# Altium project STM32 with one sensor.PrjPcb
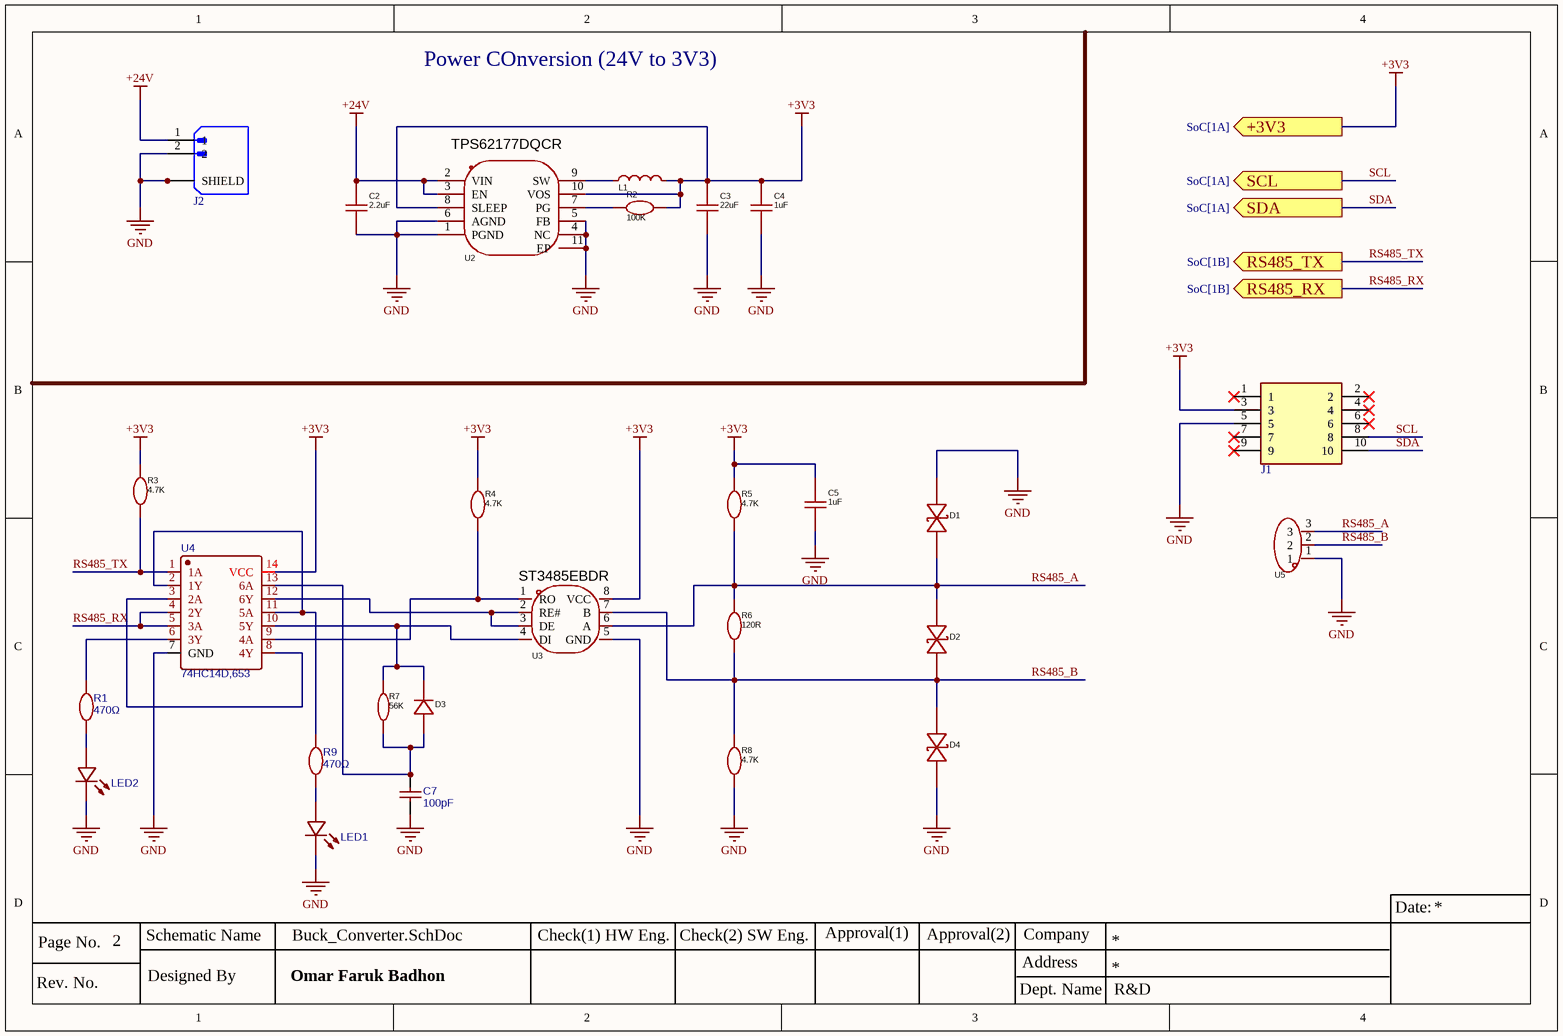
[diagram p0: Buck_Converter.SchDoc]
3 sheets, 38 parts. Net scope: flat (ports and power ports of the same name join across sheets).
Board file: PCB of SMT32.PcbDoc
Sheets:
  Project Overview.SchDoc
  Buck_Converter.SchDoc
  SoC.SchDoc

## Sheet Project Overview.SchDoc
size A4; SheetNumber: 1; SheetTotal: 3

### Notes on the sheet
- Date:
- Rev. No.
- Page No.
- Schematic Name
- Designed By
- Omar Faruk Badhon
- Check(1) HW Eng.
- Check(2) SW Eng.
- Approval(1)
- Approval(2)
- Address
- Company
- Dept. Name
- R&D

## Sheet Buck_Converter.SchDoc
size A4; SheetNumber: 2; SheetTotal: 3

### Parts
C2  2.2uF  [Cap 2.2uF]
C3  22uF  [Cap 22uF]
C4  1uF  [Cap 1uF]
C5  1uF  [Cap 1uF]
C7  100pF  [Cap 100pF]
D1  SMAJ58CA  [TVS diode]  (value not drawn)
D2  SMAJ58CA  [TVS diode]  (value not drawn)
D3  1N4148W  [1N4148W]  (value not drawn)
D4  SMAJ58CA  [TVS diode]  (value not drawn)
J1  CLP-105-02-L-D  [Sesnor Connector]  (value not drawn)
J2  Power Connector  [Power Connector]  (value not drawn)
L1  LPS4018-103MRC  [Inductor]  (value not drawn)
LED1  VLMS1300-GS08  [LED]  (value not drawn)
LED2  VLMS1300-GS08  [LED]  (value not drawn)
R1  470Ω  [Res 470R]
R2  100K  [Res 100K]
R3  4.7K  [Res 4.7K]
R4  4.7K  [Res 4.7K]
R5  4.7K  [Res 4.7K]
R6  120R  [Res 120R]
R7  56K  [Rs 56K]
R8  4.7K  [Res 4.7K]
R9  470Ω  [Res 470R]
U2  TPS62177DQCR  [TPS62177DQCR]
U3  ST3485EBDR  [ST3485EBDR]
U4  74HC14D,653  [74HC14D]
U5  733-363  [RS485 connector]  (value not drawn)

### Ports
+3V3 (out, see SoC[1A]), RS485_RX (out, see SoC[1B]), RS485_TX (out, see SoC[1B]), SCL (out, see SoC[1A]), SDA (out, see SoC[1A])

### Nets
+3V3: C3.2 C4.2 C5.2 J1.3 L1.2 R2.2 R3.2 R4.2 R5.2 U2.8(SLEEP) U2.10(VOS) U3.8(VCC) U4.14(VCC) ; port +3V3
+24V: C2.2 J2.1 U2.2(VIN) U2.3(EN)
GND: C2.1 C3.1 C4.1 C5.1 C7.1 D1.2 D4.1 J1.5 J2.2 J2.S1(SHIELD) J2.S2(SHIELD) LED1.2(C) LED2.2(C) R8.1 U2.1(PGND) U2.4(NC) U2.5(FB) U2.6(AGND) U2.11(EP) U3.5(GND) U4.7(GND) U5.1
RS485_A: D1.1 D2.2 R5.1 R6.2 U3.6(A) U5.3
RS485_B: D2.1 D4.2 R6.1 R8.2 U3.7(B) U5.2
RS485_RX: U4.4(2Y) U4.5(3A) ; port RS485_RX
RS485_TX: R3.1 U4.1(1A) ; port RS485_TX
SCL: J1.8 ; port SCL
SDA: J1.10 ; port SDA
NetC7_2: C7.2 D3.2(A) R7.1 U4.13(6A)
NetD3_1: D3.1(K) R7.2 U3.4(DI) U4.10(5Y)
NetL1_1: L1.1 U2.9(SW)
NetLED1_1: LED1.1(A) R9.1
NetLED2_1: LED2.1(A) R1.1
NetR1_2: R1.2 U4.6(3Y)
NetR2_1: R2.1 U2.7(PG)
NetR4_1: R4.1 U3.1(RO) U4.9(4A)
NetR9_2: R9.2 U4.2(1Y) U4.11(5A)
NetU3_2: U3.2(RE#) U3.3(DE) U4.12(6Y)
NetU4_3: U4.3(2A) U4.8(4Y)

Not connected (* = marked no-connect by the designer): J1 1* 2* 4* 6* 7* 9*

### Notes on the sheet
- Power COnversion (24V to 3V3)
- Date:
- Rev. No.
- Page No.
- Schematic Name
- Designed By
- Omar Faruk Badhon
- Check(1) HW Eng.
- Check(2) SW Eng.
- Approval(1)
- Approval(2)
- Address
- Company
- Dept. Name
- R&D

### Library data of the parts
C2 = GRM155R6YA225KE11D: Cap 2.2uF 35V; Manufacturer: muRata(村田); Add into BOM: yes; Tolerance: ±10%; Symbol: GRM155R6YA225KE11D; Device: GRM155R6YA225KE11D; LCSC Part Name: 2.2uF ±10% 35V; Supplier Part: C237392; Manufacturer Part: GRM155R6YA225KE11D; Supplier Footprint: 0402; JLCPCB Part Class: Extended Part; Datasheet: https://atta.szlcsc.com/upload/public/pdf/source/20200305/C490387_23319AE8C154DEB24C505E6C82A8106A.pdf; Supplier: LCSC; Convert to PCB: yes; Value: 2.2uF
C3 = GRM21BC81C226ME44L: Cap 22uF 16V; Manufacturer: muRata(村田); Add into BOM: yes; Tolerance: ±20%; Symbol: GRM21BC81C226ME44L; Device: GRM21BC81C226ME44L; LCSC Part Name: 22uF ±20% 16V; Supplier Part: C258782; Manufacturer Part: GRM21BC81C226ME44L; Supplier Footprint: 0805; JLCPCB Part Class: Extended Part; Datasheet: https://atta.szlcsc.com/upload/public/pdf/source/20200117/C258782_354729B55DBAD136BAA783E298FE5367.pdf; Supplier: LCSC; Convert to PCB: yes; Value: 22uF
C4 C5 = GCM188R71C105KA64D: Cap 1uF 16V; Manufacturer: muRata(村田); Add into BOM: yes; Tolerance: ±10%; Symbol: GCM188R71C105KA64D; Device: GCM188R71C105KA64D; LCSC Part Name: 1uF ±10% 16V; Supplier Part: C161212; Manufacturer Part: GCM188R71C105KA64D; Supplier Footprint: 0603; JLCPCB Part Class: Extended Part; Datasheet: https://atta.szlcsc.com/upload/public/pdf/source/20181221/C161212_C96DD77354D5551432B3B7779E4D1948.pdf; Supplier: LCSC; Convert to PCB: yes; Value: 1uF
C7 = 100pF: Cap 100pF 50V; Manufacturer: muRata(村田); Manufacturer Part: GCM1885C1H101JA16D; nameAlias: Value; Supplier: LCSC; Supplier Part: C126543; JLCPCB Part Class: Extended Part; spicePre: C; spiceSymbolName: GCM1885C1H101JA16D
D1 D2 D4 = SMAJ58CA_C148235: Manufacturer: Littelfuse(美国力特); Add into BOM: yes; Reverse Stand-Off Voltage (Vrwm): 58V; Maximum Clamping Voltage: 93.6V; Peak Pulse Current (Ipp): 4.3A; Peak Pulse Power Dissipation (Ppp): 400W; Breakdown Voltage: 64.4V; Type: TVS; Symbol: SMAJ58CA_C148235; Device: SMAJ58CA_C148235; LCSC Part Name: SMAJ58CA; Supplier Part: C148235; Manufacturer Part: SMAJ58CA; Supplier Footprint: SMA(DO-214AC); JLCPCB Part Class: Extended Part; Datasheet: https://atta.szlcsc.com/upload/public/pdf/source/20190402/C374025_5ACE77BC72947DF13CF0CBC7F8B57228.pdf; Supplier: LCSC; Convert to PCB: yes
D3 = 1N4148W: Manufacturer: Agertech(艾吉芯); Symbol: 1N4148W_C2840961; Add into BOM: yes; Forward Voltage (Vf@If): 1.25V@150mA; Reverse Leakage Current: 1uA@75V; Device: 1N4148W_C2840961; LCSC Part Name: 电压:100V 电流:150mA; Supplier Part: C2840961; Manufacturer Part: 1N4148W; Supplier Footprint: SOD-123W; JLCPCB Part Class: Extended Part; Datasheet: https://atta.szlcsc.com/upload/public/pdf/source/20210624/C2840961_71DFB6950E76A457E5EE196072A9BD23.pdf; Supplier: LCSC; Convert to PCB: yes; Operating Temperature: -55℃~+150℃@(Tj)
J1 = CLP-105-02-L-D: 1.27mm 1.27mm Double Row Tin 3.3A -55℃~+125℃ 10P Standing paste 2.29mm SMD,P=1.27mm Female Headers ROHS; Package: None; Price: None; Value: *; MP: CLP-105-02-L-D; Availability: Unavailable
J2 = Power Connector: Picoblade Connector, 2 Circuit Single Row, Right Angle Surface Mount SMT PCB; MF: {'manufacturer': u'Molex'}; MP: 0532610271; Availability: Unavailable; Package: None; Value: *; Price: None
L1 = LPS4018-103MRC: Inductor 10uH; Manufacturer: Coilcraft(线艺); Add into BOM: yes; Symbol: LPS4018-103MRC; Device: LPS4018-103MRC; LCSC Part Name: LPS4018-103MRC; Supplier Part: C6127589; Manufacturer Part: LPS4018-103MRC; Supplier Footprint: SMD,3.9x3.9mm; JLCPCB Part Class: Extended Part; Datasheet: https://atta.szlcsc.com/upload/public/pdf/source/20220705/4A26DAB81CB6B332CC15AA1D7F647266.pdf; Supplier: LCSC; Convert to PCB: yes
LED1 LED2 = VLMS1300-GS08: Led; Manufacturer: VISHAY(威世); Contributor: LCSC; Supplier: LCSC; Supplier Part: C83242; Manufacturer Part: VLMS1300-GS08; JLCPCB Part Class: Extended Part; spicePre: L; spiceSymbolName: VLMS1300-GS08
R1 R9 = 470Ω: Res 470R; Manufacturer: PANASONIC(松下); Manufacturer Part: ERJPA3F4700V; nameAlias: Value; Contributor: lcsc; Supplier: LCSC; Supplier Part: C441919; JLCPCB Part Class: Extended Part; spicePre: R; spiceSymbolName: ERJPA3F4700V
R2 = ERA2AEB104X: Res 100K 50V; Manufacturer: PANASONIC(松下); Add into BOM: yes; Value: 100kΩ; Tolerance: ±0.1%; Temperature Coefficient: ±25ppm/℃; Symbol: ERA2AEB104X; Device: ERA2AEB104X; LCSC Part Name: 100kΩ ±0.1% 63mW 薄膜电阻; Supplier Part: C445619; Manufacturer Part: ERA2AEB104X; Supplier Footprint: 0402; JLCPCB Part Class: Extended Part; Supplier: LCSC; Convert to PCB: yes; Type: Thin Film Resistor; Operating Temperature Range: -55℃~+155℃
R3-R5 R8 = ERJPA3F4701V: Res 4.7K; Manufacturer: PANASONIC(松下); Add into BOM: yes; Value: 4.7kΩ; Tolerance: ±1%; Power(Watts): 333mW; Temperature Coefficient: ±100ppm/℃; Symbol: ERJPA3F4701V; Device: ERJPA3F4701V; LCSC Part Name: 4.7kΩ ±1% 333mW 厚膜电阻; Supplier Part: C441924; Manufacturer Part: ERJPA3F4701V; Supplier Footprint: 0603; JLCPCB Part Class: Extended Part; Supplier: LCSC; Convert to PCB: yes; Type: Thick Film Resistors; Overload Voltage (Max): -; Operating Temperature Range: -55℃~+155℃
R6 = ERJPA3F1200V: Res 120R; Manufacturer: PANASONIC(松下); Add into BOM: yes; Value: 120Ω; Tolerance: ±1%; Power(Watts): 250mW; Temperature Coefficient: ±100ppm/℃; Symbol: ERJPA3F1200V; Device: ERJPA3F1200V; LCSC Part Name: 120Ω ±1% 250mW 厚膜电阻; Supplier Part: C543338; Manufacturer Part: ERJPA3F1200V; Supplier Footprint: 0603; JLCPCB Part Class: Extended Part; Datasheet: https://atta.szlcsc.com/upload/public/pdf/source/20200515/C543414_D3FB4A44C151AC19BA141503575FC797.pdf; Supplier: LCSC; Convert to PCB: yes; Type: Thick Film Resistors; Overload Voltage (Max): -; Operating Temperature Range: -55℃~+155℃
R7 = ERJ3EKF5602V: Res 56K; Manufacturer: PANASONIC(松下); Add into BOM: yes; Value: 56kΩ; Tolerance: ±1%; Temperature Coefficient: ±100ppm/℃; Symbol: ERJ3EKF5602V; Device: ERJ3EKF5602V; LCSC Part Name: 56kΩ ±1% 100mW 厚膜电阻; Supplier Part: C278629; Manufacturer Part: ERJ3EKF5602V; Supplier Footprint: 0603; JLCPCB Part Class: Extended Part; Datasheet: https://atta.szlcsc.com/upload/public/pdf/source/20181114/C278629_181D62B106189050D6A2EF7256E211B4.pdf; Supplier: LCSC; Convert to PCB: yes; Type: Thick Film Resistors; Overload Voltage (Max): -; Operating Temperature Range: -55℃~+155℃
U2 = TPS62177DQCR: Manufacturer: TI(德州仪器); Add into BOM: yes; Function: Step-down type; Switch tube (built-in/external): 内置; Symbol: TPS62177DQCR; Device: TPS62177DQCR; LCSC Part Name: TPS62177DQCR; Supplier Part: C91241; Manufacturer Part: TPS62177DQCR; Supplier Footprint: WSON-10-EP(2x3); JLCPCB Part Class: Extended Part; Datasheet: https://www.ti.com/cn/lit/gpn/tps62177; Supplier: LCSC; Convert to PCB: yes; Input Voltage: -; Output Current (Max): -; Switching Frequency: -; Synchronous Rectification: -; Number of Outputs: -; Topology: -
U3 = ST3485EBDR: Manufacturer: ST(意法半导体); Add into BOM: yes; Types: transceiver; Supply Voltage: 3V~3.6V; Data Rate: 15Mbps; Driver/receiver: 1/1; Node Number: 64; ESD Protect: ±12kV; Whether the isolation: NO; Symbol: ST3485EBDR; Device: ST3485EBDR; LCSC Part Name: 3.3V供电 15Mbps 带静电保护收发器; Supplier Part: C75809; Manufacturer Part: ST3485EBDR; Supplier Footprint: SO-8; JLCPCB Part Class: Extended Part; Datasheet: https://atta.szlcsc.com/upload/public/pdf/source/20181012/C75809_EC9EE9FC1B4AC7950854237FAEE73CA1.pdf; Supplier: LCSC; Convert to PCB: yes; Operating Temperature: -40℃~+85℃
U4 = 74HC14D,653: Manufacturer: Nexperia(安世); spicePre: X; Supplier: LCSC; Manufacturer Part: 74HC14D,653; Supplier Part: C5605; JLCPCB Part Class: Basic Part; spiceSymbolName: 74HC14D,653
U5 = RS485 Connector: 6A 3 Straight Needle -60℃~+100℃ 1 2.5mm Gray Plugin,P=2.5mm  Pluggable System Terminal Block ROHS; Manufacturer: WAGO(万可); Add into BOM: yes; Number of PINs Per Row: 3; Symbol: 733-363; Device: 733-363; LCSC Part Name: 2.5mm 排数:1 每排P数:3; Supplier Part: C3579942; Manufacturer Part: 733-363; Supplier Footprint: 插件,P=2.5mm; JLCPCB Part Class: Extended Part; Datasheet: https://atta.szlcsc.com/upload/public/pdf/source/20240407/CB0328B38B61B769306C444AB4F51080.pdf; Supplier: LCSC; Convert to PCB: yes; Structure: -; Pitch: 2.5mm; Color: Gray; Mounting Style: Straight Needle; Number of Pins: 3P; Number of Rows: 1; Current Rating (Max): 6A; Operating Temperature Range: -60℃~+100℃

## Sheet SoC.SchDoc
size A4; SheetNumber: 3; SheetTotal: 3
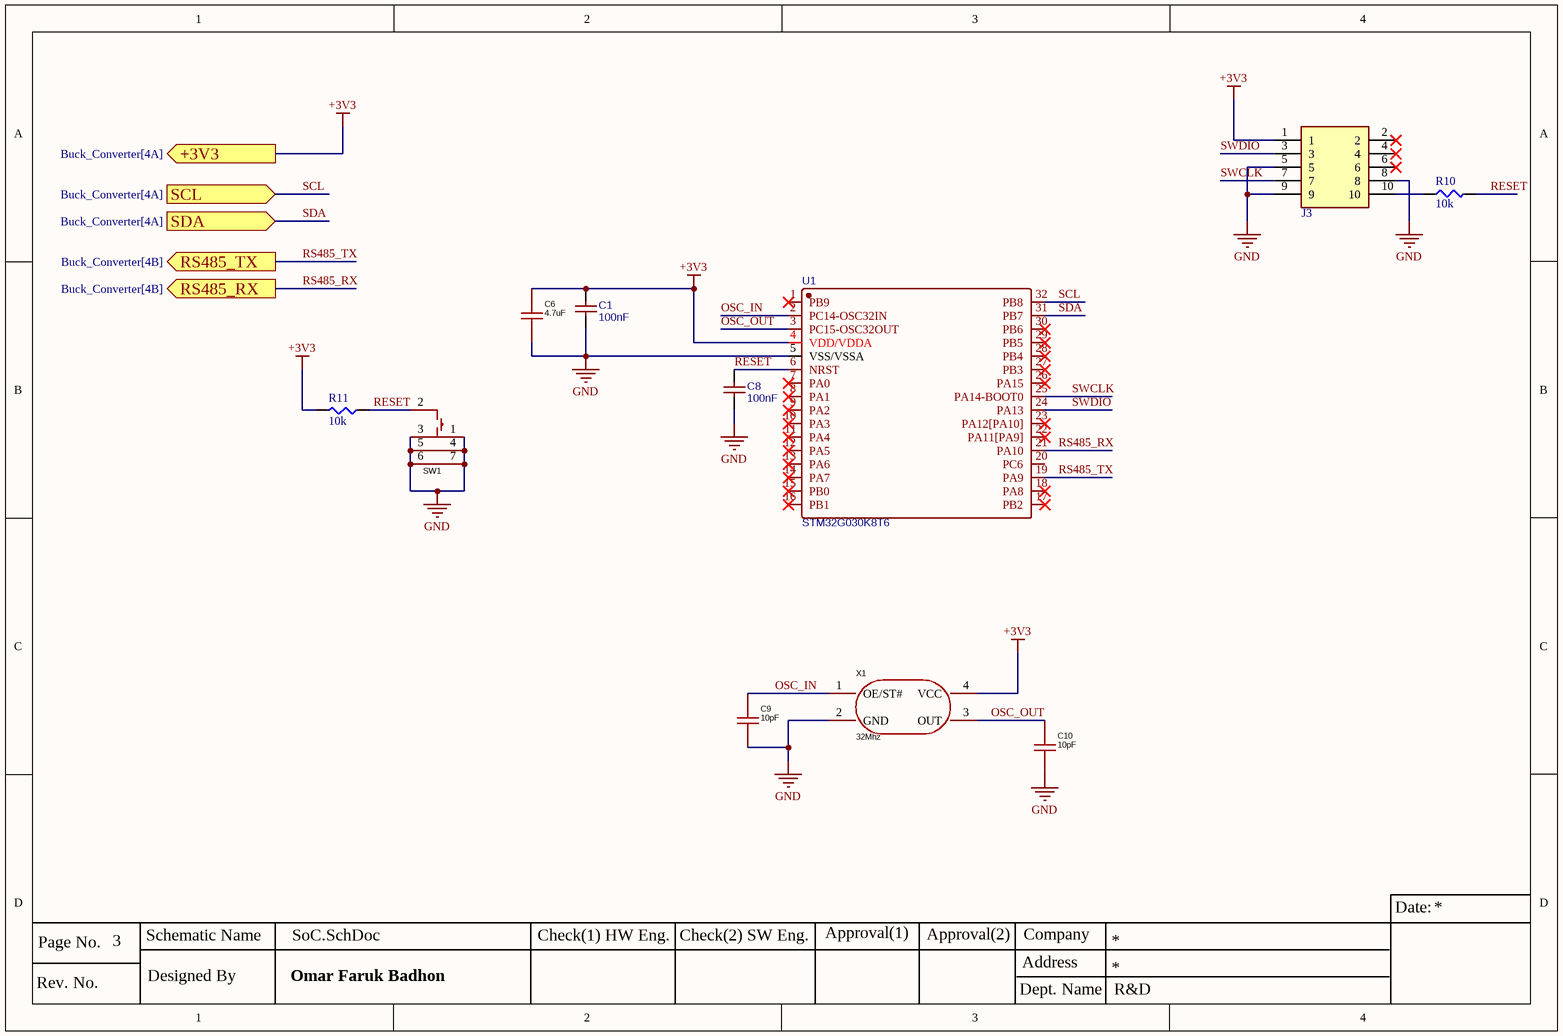
[diagram p1: SoC.SchDoc]

### Parts
C1  100nF  [Cap 100nF 16V]
C6  4.7uF  [Cap 4.7uF]
C8  100nF  [Cap 100nF 16V]
C9  10pF  [Cap 10pF]
C10  10pF  [Cap 10pF]
J3  20021121-00010C4LF  [JTAG]  (value not drawn)
R10  10k  [Res 10K]
R11  10k  [Res 10K]
SW1  TSA020B3418A02  [Push Button]  (value not drawn)
U1  STM32G030K8T6  [STM32G030K8T6]
X1  32Mhz  [Crystal 32MHz]

### Ports
+3V3 (out, see Buck_Converter[4A]), RS485_RX (out, see Buck_Converter[4B]), RS485_TX (out, see Buck_Converter[4B]), SCL (in, see Buck_Converter[4A]), SDA (in, see Buck_Converter[4A])

### Nets
+3V3: C1.2 C6.1 J3.1 R11.2 U1.4(VDD/VDDA) X1.4(VCC) ; port +3V3
GND: C1.1 C6.2 C8.1 C9.1 C10.1 J3.5 J3.8 J3.9 SW1.1 SW1.3 SW1.4 SW1.5 SW1.6 SW1.7 U1.5(VSS/VSSA) X1.2(GND)
OSC_IN: C9.2 U1.2(PC14-OSC32IN) X1.1(OE/ST#)
OSC_OUT: C10.2 U1.3(PC15-OSC32OUT) X1.3(OUT)
RESET: C8.2 R10.2 R11.1 SW1.2 U1.6(NRST)
RS485_RX: U1.21(PA10) ; port RS485_RX
RS485_TX: U1.19(PA9) ; port RS485_TX
SCL: U1.32(PB8) ; port SCL
SDA: U1.31(PB7) ; port SDA
SWCLK: J3.7 U1.25(PA14-BOOT0)
SWDIO: J3.3 U1.24(PA13)
NetJ3_10: J3.10 R10.1

Not connected (* = marked no-connect by the designer): J3 2* 4* 6*; U1 1(PB9)* 7(PA0)* 8(PA1)* 9(PA2)* 10(PA3)* 11(PA4)* 12(PA5)* 13(PA6)* 14(PA7)* 15(PB0)* 16(PB1)* 17(PB2)* 18(PA8)* 20(PC6) 22(PA11[PA9])* 23(PA12[PA10])* 26(PA15)* 27(PB3)* 28(PB4)* 29(PB5)* 30(PB6)*

### Notes on the sheet
- Date:
- Rev. No.
- Page No.
- Schematic Name
- Designed By
- Omar Faruk Badhon
- Check(1) HW Eng.
- Check(2) SW Eng.
- Approval(1)
- Approval(2)
- Address
- Company
- Dept. Name
- R&D

### Library data of the parts
C1 C8 = Cap 100nF: 16V 100nF X7R ±10% 0603 Multilayer Ceramic Capacitors MLCC - SMD/SMT ROHS; Manufacturer: muRata(村田); Manufacturer Part: GRM188R71C104KA01D; nameAlias: Value; Supplier: LCSC; Supplier Part: C45000; JLCPCB Part Class: Extended Part; spicePre: C; spiceSymbolName: GRM188R71C104KA01D
C6 = GRM188C71C475KE21D: 16V 4.7uF X7S ±10% 0603 Multilayer Ceramic Capacitors MLCC - SMD/SMT ROHS; Manufacturer: muRata(村田); Add into BOM: yes; Symbol: GRM188C71C475KE21D; Device: GRM188C71C475KE21D; LCSC Part Name: 4.7uF ±10% 16V; Supplier Part: C237615; Manufacturer Part: GRM188C71C475KE21D; Supplier Footprint: 0603; JLCPCB Part Class: Extended Part; Datasheet: https://atta.szlcsc.com/upload/public/pdf/source/20200305/C490387_23319AE8C154DEB24C505E6C82A8106A.pdf; Supplier: LCSC; Convert to PCB: yes; Value: 4.7uF; Tolerance: ±10%
C9 C10 = Cap 10pF: 25V 10pF NP0 ±5% 0603  Multilayer Ceramic Capacitors MLCC - SMD/SMT ROHS; Manufacturer: YAGEO(国巨); Symbol: CC0603JRNPO8BN100; Add into BOM: yes; Device: CC0603JRNPO8BN100; LCSC Part Name: 10pF ±5% 25V; Supplier Part: C1853175; Manufacturer Part: CC0603JRNPO8BN100; Supplier Footprint: 0603; JLCPCB Part Class: Extended Part; Datasheet: https://atta.szlcsc.com/upload/public/pdf/source/20210519/C1853175_08ABFC5682B471E6C773F36F7C78F8CE.pdf; Supplier: LCSC; Convert to PCB: yes; Value: 10pF; Tolerance: ±5%
J3 = JTAG: Headers & Wire Housings 1.27x1.27mm BTB, Hdr Unshrd, SMT, 10 Pos; Manufacturer_Name: Amphenol; Geometry.Height: 5.7mm; Mouser Part Number: 649-202112100010C4LF; Mouser Price/Stock: https://www.mouser.co.uk/ProductDetail/Amphenol-FCI/20021121-00010C4LF?qs=iIVTEDlrHA1ddfCJGH4Nhg%3D%3D; Manufacturer_Part_Number: 20021121-00010C4LF; Datasheet Link: https://cdn.amphenol-cs.com/media/wysiwyg/files/drawing/20021121.pdf
R10 R11 = ERJ-PA3F1002V_1: RES SMD 10K OHM 1% 1/4W 0603; Manufacturer: Panasonic Electronic Components; Factory Stock: 0; Unit Price (USD): 0.02372; @ qty: 1500; Minimum Quantity: 1; Power (Watts): 0.25W, 1/4W; Temperature Coefficient: ±100ppm/°C; Part Number: ERJ-PA3F1002V; Datasheets: https://industrial.panasonic.com/cdbs/www-data/pdf/RDA0000/AOA0000C243.pdf; Image: //media.digikey.com/Photos/Panasonic%20Photos/MFG_ERJ-P6W%20Series.jpg; Digi-Key Part Number: P10KBYCT-ND; Quantity Available: 12488; Packaging: Cut Tape (CT); Series: ERJ; Part Status: Active; Value: 10k; Tolerance: ±1%; Composition: Thick Film; Features: Automotive AEC-Q200, Pulse Withstanding; Operating Temperature: -55°C ~ 155°C; Package / Case: 0603 (1608 Metric); Supplier Device Package: 0603; Size / Dimension: 0.063" L x 0.031" W (1.60mm x 0.80mm); Height - Seated (Max): 0.022" (0.55mm); Number of Terminations: 2; Failure Rate: -
SW1 = Push Button: Manufacturer: BZCN(博众电气); Add into BOM: yes; Actuator Style: Round Button; Operating Force: 180gf; Switch Length: 4.5mm; Switch Width: 3.4mm; Contact Current: 50mA; Voltage Rating (DC): 12V; Symbol: TSA020B3418A02; Device: TSA020B3418A02; LCSC Part Name: 4.5*3.4*3.4mm 卧贴 轻触开关; Supplier Part: C2888897; Manufacturer Part: TSA020B3418A02; Supplier Footprint: SMD; JLCPCB Part Class: Extended Part; Datasheet: https://atta.szlcsc.com/upload/public/pdf/source/20210826/A0412DE55436A0A9154118D90A036ADB.pdf; Supplier: LCSC; Convert to PCB: yes; Mounting Style: Surface Mount; Switch Height: 3.4mm; Voltage Rating (AC): -; Mechanical Life: -
U1 = STM32G030K8T6: Manufacturer: ST(意法半导体); Contributor: LCSC; Supplier: LCSC; Supplier Part: C431631; Manufacturer Part: STM32G030K8T6; JLCPCB Part Class: Extended Part; spicePre: U; spiceSymbolName: STM32G030K8T6
X1 = Crystal: Manufacturer: EPSON(爱普生); Symbol: X1G004481000900; Device: X1G0044810009; Add into BOM: yes; Supply Voltage: 1.6V~3.6V; Supply Current (Max): 3mA; Frequency Stability(Full temperature range): ±100ppm; LCSC Part Name: X1G0044810009; Supplier Part: C70524; Manufacturer Part: X1G0044810009; Supplier Footprint: SMD7050-4P; JLCPCB Part Class: Extended Part; Datasheet: https://atta.szlcsc.com/upload/public/pdf/source/20161110/1478747518408.pdf; Supplier: LCSC; Convert to PCB: yes; Value: 32MHz; Operating Temperature: -40℃~+85℃

## Nets that join several sheets
+3V3: Buck_Converter (13 pins), SoC (6 pins)
GND: Buck_Converter (22 pins), SoC (16 pins)
RS485_RX: Buck_Converter (U4.4 U4.5), SoC (U1.21)
RS485_TX: Buck_Converter (R3.1 U4.1), SoC (U1.19)
SCL: Buck_Converter (J1.8), SoC (U1.32)
SDA: Buck_Converter (J1.10), SoC (U1.31)